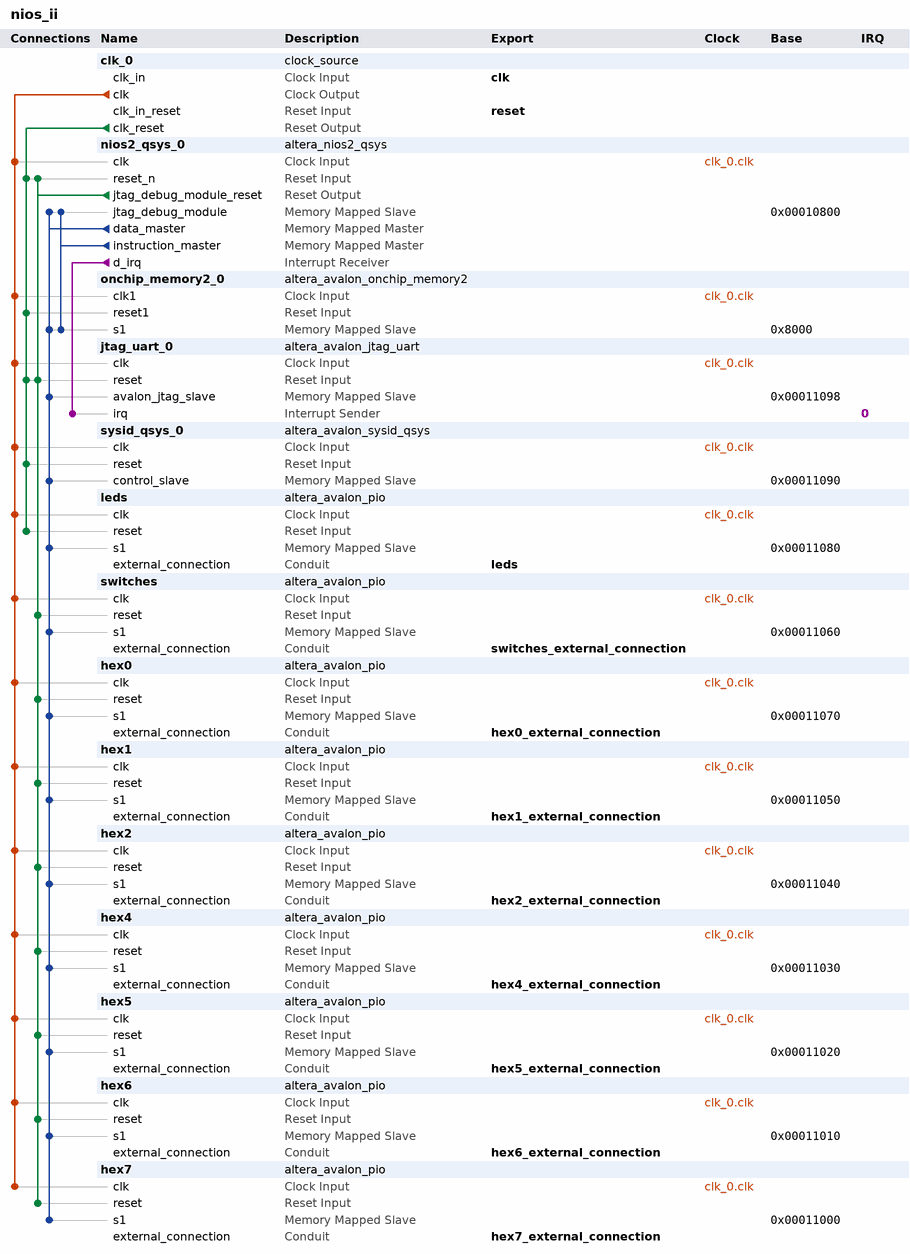
[diagram p0: system contents]
# Platform Designer (Qsys) system nios_ii, Cyclone II Unknown
# Parameters at their usual value, and those the tool derives, are not listed.
package require -exact qsys 13.0.1.99.2
create_system nios_ii
set_project_property DEVICE_FAMILY {Cyclone II}
set_project_property DEVICE Unknown

add_instance clk_0 clock_source 13.0
set_instance_parameter_value clk_0 clockFrequency 50000000

add_instance nios2_qsys_0 altera_nios2_qsys 13.0
set_instance_parameter_value nios2_qsys_0 resetSlave onchip_memory2_0.s1
set_instance_parameter_value nios2_qsys_0 mmu_TLBMissExcSlave None
set_instance_parameter_value nios2_qsys_0 exceptionSlave onchip_memory2_0.s1
set_instance_parameter_value nios2_qsys_0 breakSlave nios2_qsys_0.jtag_debug_module
set_instance_parameter_value nios2_qsys_0 impl Tiny
set_instance_parameter_value nios2_qsys_0 icache_size 4096

add_instance onchip_memory2_0 altera_avalon_onchip_memory2 13.0.1.99.2
set_instance_parameter_value onchip_memory2_0 dataWidth 32
set_instance_parameter_value onchip_memory2_0 dualPort false
set_instance_parameter_value onchip_memory2_0 initMemContent false
set_instance_parameter_value onchip_memory2_0 initializationFileName onchip_mem.hex
set_instance_parameter_value onchip_memory2_0 memorySize 20000

add_instance jtag_uart_0 altera_avalon_jtag_uart 13.0.1.99.2
set_instance_parameter_value jtag_uart_0 simInteractiveOptions NO_INTERACTIVE_WINDOWS

add_instance sysid_qsys_0 altera_avalon_sysid_qsys 13.0
set_instance_parameter_value sysid_qsys_0 id 0

add_instance leds altera_avalon_pio 13.0.1.99.2
set_instance_parameter_value leds direction Output
set_instance_parameter_value leds width 10

add_instance switches altera_avalon_pio 13.0.1.99.2
set_instance_parameter_value switches direction Input
set_instance_parameter_value switches width 16

add_instance hex0 altera_avalon_pio 13.0.1.99.2
set_instance_parameter_value hex0 direction Output
set_instance_parameter_value hex0 width 7

add_instance hex1 altera_avalon_pio 13.0.1.99.2
set_instance_parameter_value hex1 direction Output
set_instance_parameter_value hex1 width 7

add_instance hex2 altera_avalon_pio 13.0.1.99.2
set_instance_parameter_value hex2 direction Output
set_instance_parameter_value hex2 width 7

add_instance hex4 altera_avalon_pio 13.0.1.99.2
set_instance_parameter_value hex4 direction Output
set_instance_parameter_value hex4 width 7

add_instance hex5 altera_avalon_pio 13.0.1.99.2
set_instance_parameter_value hex5 direction Output
set_instance_parameter_value hex5 width 7

add_instance hex6 altera_avalon_pio 13.0.1.99.2
set_instance_parameter_value hex6 direction Output
set_instance_parameter_value hex6 width 7

add_instance hex7 altera_avalon_pio 13.0.1.99.2
set_instance_parameter_value hex7 direction Output
set_instance_parameter_value hex7 width 7

# connections
add_connection clk_0.clk hex0.clk clock
add_connection clk_0.clk hex1.clk clock
add_connection clk_0.clk hex2.clk clock
add_connection clk_0.clk hex4.clk clock
add_connection clk_0.clk hex5.clk clock
add_connection clk_0.clk hex6.clk clock
add_connection clk_0.clk hex7.clk clock
add_connection clk_0.clk jtag_uart_0.clk clock
add_connection clk_0.clk leds.clk clock
add_connection clk_0.clk nios2_qsys_0.clk clock
add_connection clk_0.clk onchip_memory2_0.clk1 clock
add_connection clk_0.clk switches.clk clock
add_connection clk_0.clk sysid_qsys_0.clk clock
add_connection clk_0.clk_reset jtag_uart_0.reset reset
add_connection clk_0.clk_reset leds.reset reset
add_connection clk_0.clk_reset nios2_qsys_0.reset_n reset
add_connection clk_0.clk_reset onchip_memory2_0.reset1 reset
add_connection clk_0.clk_reset sysid_qsys_0.reset reset
add_connection nios2_qsys_0.jtag_debug_module_reset hex0.reset reset
add_connection nios2_qsys_0.jtag_debug_module_reset hex1.reset reset
add_connection nios2_qsys_0.jtag_debug_module_reset hex2.reset reset
add_connection nios2_qsys_0.jtag_debug_module_reset hex4.reset reset
add_connection nios2_qsys_0.jtag_debug_module_reset hex5.reset reset
add_connection nios2_qsys_0.jtag_debug_module_reset hex6.reset reset
add_connection nios2_qsys_0.jtag_debug_module_reset hex7.reset reset
add_connection nios2_qsys_0.jtag_debug_module_reset jtag_uart_0.reset reset
add_connection nios2_qsys_0.jtag_debug_module_reset nios2_qsys_0.reset_n reset
add_connection nios2_qsys_0.jtag_debug_module_reset switches.reset reset
add_connection nios2_qsys_0.data_master hex0.s1 avalon
set_connection_parameter_value nios2_qsys_0.data_master/hex0.s1 baseAddress 0x00011070
add_connection nios2_qsys_0.data_master hex1.s1 avalon
set_connection_parameter_value nios2_qsys_0.data_master/hex1.s1 baseAddress 0x00011050
add_connection nios2_qsys_0.data_master hex2.s1 avalon
set_connection_parameter_value nios2_qsys_0.data_master/hex2.s1 baseAddress 0x00011040
add_connection nios2_qsys_0.data_master hex4.s1 avalon
set_connection_parameter_value nios2_qsys_0.data_master/hex4.s1 baseAddress 0x00011030
add_connection nios2_qsys_0.data_master hex5.s1 avalon
set_connection_parameter_value nios2_qsys_0.data_master/hex5.s1 baseAddress 0x00011020
add_connection nios2_qsys_0.data_master hex6.s1 avalon
set_connection_parameter_value nios2_qsys_0.data_master/hex6.s1 baseAddress 0x00011010
add_connection nios2_qsys_0.data_master hex7.s1 avalon
set_connection_parameter_value nios2_qsys_0.data_master/hex7.s1 baseAddress 0x00011000
add_connection nios2_qsys_0.data_master jtag_uart_0.avalon_jtag_slave avalon
set_connection_parameter_value nios2_qsys_0.data_master/jtag_uart_0.avalon_jtag_slave baseAddress 0x00011098
add_connection nios2_qsys_0.data_master leds.s1 avalon
set_connection_parameter_value nios2_qsys_0.data_master/leds.s1 baseAddress 0x00011080
add_connection nios2_qsys_0.data_master nios2_qsys_0.jtag_debug_module avalon
set_connection_parameter_value nios2_qsys_0.data_master/nios2_qsys_0.jtag_debug_module baseAddress 0x00010800
add_connection nios2_qsys_0.data_master onchip_memory2_0.s1 avalon
set_connection_parameter_value nios2_qsys_0.data_master/onchip_memory2_0.s1 baseAddress 0x8000
add_connection nios2_qsys_0.data_master switches.s1 avalon
set_connection_parameter_value nios2_qsys_0.data_master/switches.s1 baseAddress 0x00011060
add_connection nios2_qsys_0.data_master sysid_qsys_0.control_slave avalon
set_connection_parameter_value nios2_qsys_0.data_master/sysid_qsys_0.control_slave baseAddress 0x00011090
add_connection nios2_qsys_0.instruction_master nios2_qsys_0.jtag_debug_module avalon
set_connection_parameter_value nios2_qsys_0.instruction_master/nios2_qsys_0.jtag_debug_module baseAddress 0x00010800
add_connection nios2_qsys_0.instruction_master onchip_memory2_0.s1 avalon
set_connection_parameter_value nios2_qsys_0.instruction_master/onchip_memory2_0.s1 baseAddress 0x8000
add_connection nios2_qsys_0.d_irq jtag_uart_0.irq interrupt
set_connection_parameter_value nios2_qsys_0.d_irq/jtag_uart_0.irq irqNumber 0

# exported interfaces
add_interface clk clock sink
set_interface_property clk EXPORT_OF clk_0.clk_in
add_interface reset reset sink
set_interface_property reset EXPORT_OF clk_0.clk_in_reset
add_interface leds conduit end
set_interface_property leds EXPORT_OF leds.external_connection
add_interface hex0_external_connection conduit end
set_interface_property hex0_external_connection EXPORT_OF hex0.external_connection
add_interface switches_external_connection conduit end
set_interface_property switches_external_connection EXPORT_OF switches.external_connection
add_interface hex1_external_connection conduit end
set_interface_property hex1_external_connection EXPORT_OF hex1.external_connection
add_interface hex2_external_connection conduit end
set_interface_property hex2_external_connection EXPORT_OF hex2.external_connection
add_interface hex4_external_connection conduit end
set_interface_property hex4_external_connection EXPORT_OF hex4.external_connection
add_interface hex5_external_connection conduit end
set_interface_property hex5_external_connection EXPORT_OF hex5.external_connection
add_interface hex6_external_connection conduit end
set_interface_property hex6_external_connection EXPORT_OF hex6.external_connection
add_interface hex7_external_connection conduit end
set_interface_property hex7_external_connection EXPORT_OF hex7.external_connection

set_interconnect_requirement {$system} qsys_mm.clockCrossingAdapter HANDSHAKE
set_interconnect_requirement {$system} qsys_mm.maxAdditionalLatency 1

save_system nios_ii.qsys
